# Altium schematic sheet Relays.SchDoc
size Letter; SheetNumber: 1; SheetTotal: 5
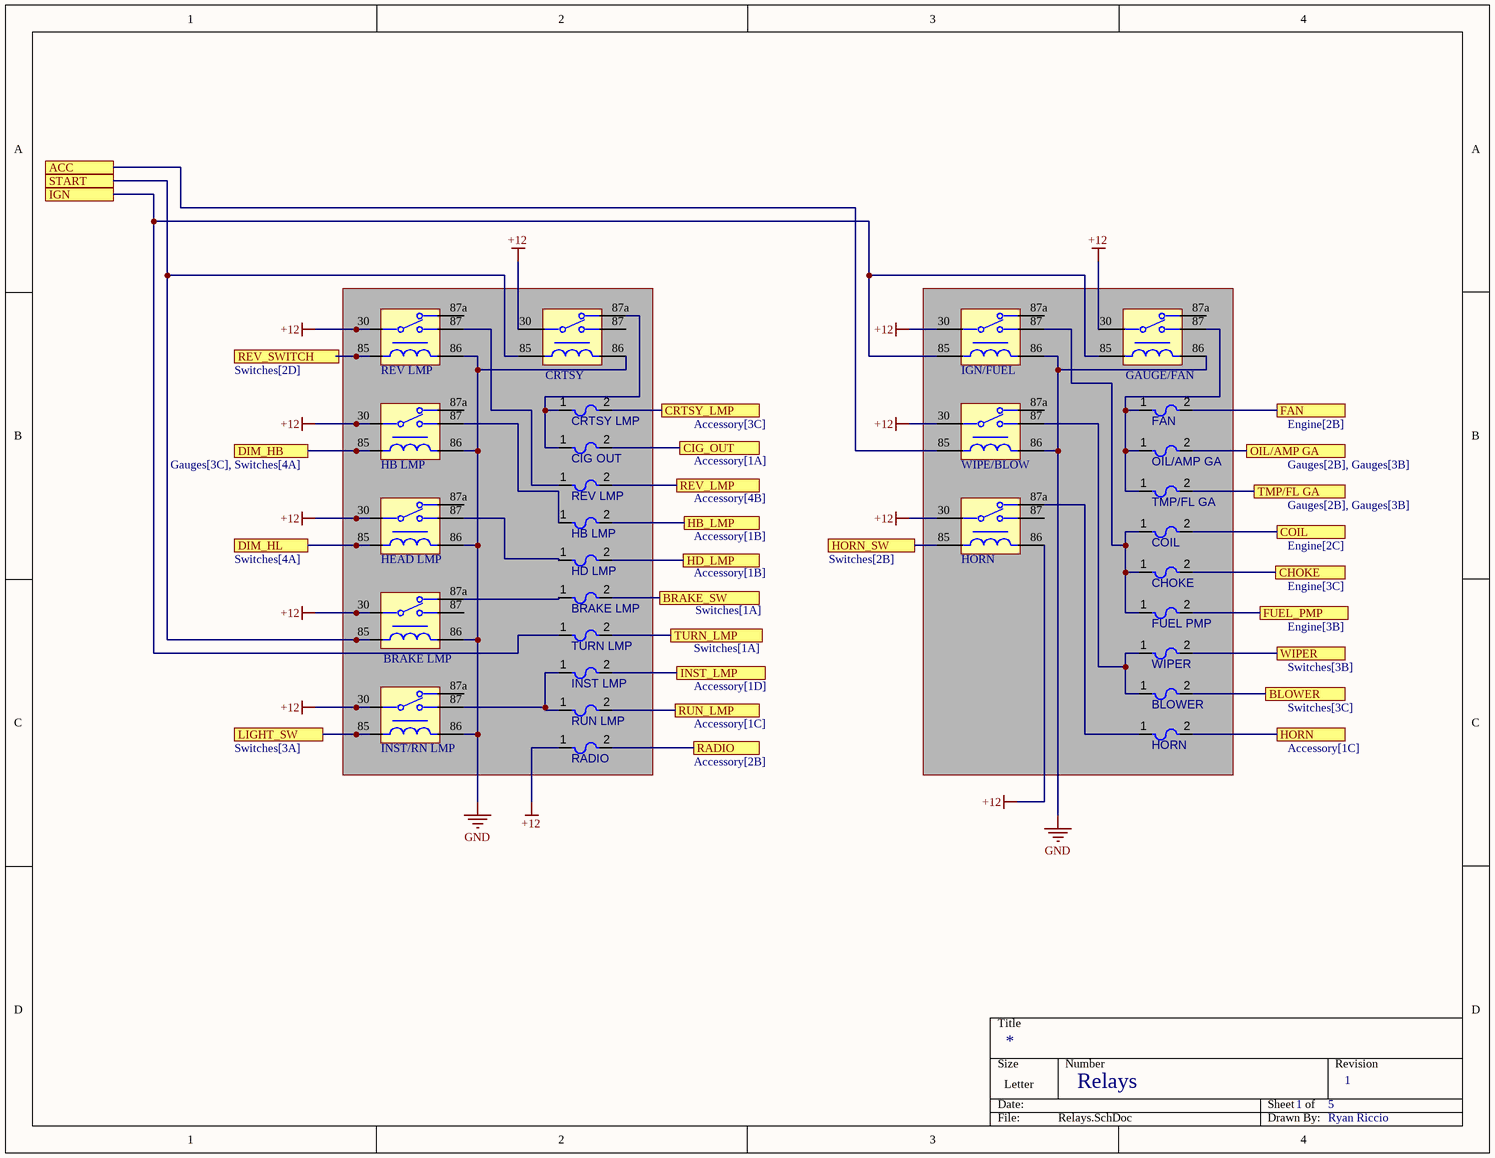
[diagram p0: Relays.SchDoc]

## Parts
(Parts that share a designator on the sheet are numbered #1, #2 ... from top to bottom, then left to right.)
F?#1  CRTSY LMP  [LFUS-467_V]
F?#2  FAN  [LFUS-467_V]
F?#3  CIG OUT  [LFUS-467_V]
F?#4  OIL/AMP GA  [LFUS-467_V]
F?#5  REV LMP  [LFUS-467_V]
F?#6  TMP/FL GA  [LFUS-467_V]
F?#7  HB LMP  [LFUS-467_V]
F?#8  COIL  [LFUS-467_V]
F?#9  HD LMP  [LFUS-467_V]
F?#10  CHOKE  [LFUS-467_V]
F?#11  BRAKE LMP  [LFUS-467_V]
F?#12  FUEL PMP  [LFUS-467_V]
F?#13  TURN LMP  [LFUS-467_V]
F?#14  WIPER  [LFUS-467_V]
F?#15  INST LMP  [LFUS-467_V]
F?#16  BLOWER  [LFUS-467_V]
F?#17  RUN LMP  [LFUS-467_V]
F?#18  HORN  [LFUS-467_V]
F?#19  RADIO  [LFUS-467_V]
K?#1  REV LMP  [FP-CB1-P-12V-MFG]
K?#2  CRTSY  [FP-CB1-P-12V-MFG]
K?#3  IGN/FUEL  [FP-CB1-P-12V-MFG]
K?#4  GAUGE/FAN  [FP-CB1-P-12V-MFG]
K?#5  HB LMP  [FP-CB1-P-12V-MFG]
K?#6  WIPE/BLOW  [FP-CB1-P-12V-MFG]
K?#7  HEAD LMP  [FP-CB1-P-12V-MFG]
K?#8  HORN  [FP-CB1-P-12V-MFG]
K?#9  BRAKE LMP  [FP-CB1-P-12V-MFG]
K?#10  INST/RN LMP  [FP-CB1-P-12V-MFG]

## Ports
ACC (see Accessory[2B], Switches[1D]), BLOWER (see Switches[3C]), BRAKE_SW (see Switches[1A]), CHOKE (see Engine[3C]), CIG_OUT (see Accessory[1A]), COIL (see Engine[2C]), CRTSY_LMP (see Accessory[3C]), DIM_HB (see Gauges[3C], Switches[4A]), DIM_HL (see Switches[4A]), FAN (see Engine[2B]), FUEL_PMP (see Engine[3B]), HB_LMP (see Accessory[1B]), HD_LMP (see Accessory[1B]), HORN (see Accessory[1C]), HORN_SW (see Switches[2B]), IGN (see Switches[2C], Switches[2D], Switches[3A]), INST_LMP (see Accessory[1D]), LIGHT_SW (see Switches[3A]), OIL/AMP GA (see Gauges[2B], Gauges[3B]), RADIO (see Accessory[2B]), REV_LMP (see Accessory[4B]), REV_SWITCH (see Switches[2D]), RUN_LMP (see Accessory[1C]), START (see Switches[2D]), TMP/FL GA (see Gauges[2B], Gauges[3B]), TURN_LMP (see Switches[1A]), WIPER (see Switches[3B])

## Nets
+12: F?#19.1 K?#1.30 K?#2.30 K?#3.30 K?#4.30 K?#5.30 K?#6.30 K?#7.30 K?#8.30 K?#8.86 K?#9.30 K?#10.30
GND: K?#1.86 K?#2.86 K?#3.86 K?#4.86 K?#5.86 K?#6.86 K?#7.86 K?#9.86 K?#10.86
ACC: K?#6.85 ; port ACC
BLOWER: F?#16.2 ; port BLOWER
BRAKE_SW: F?#11.2 ; port BRAKE_SW
CHOKE: F?#10.2 ; port CHOKE
CIG_OUT: F?#3.2 ; port CIG_OUT
COIL: F?#8.2 ; port COIL
CRTSY_LMP: F?#1.2 ; port CRTSY_LMP
DIM_HB: K?#5.85 ; port DIM_HB
DIM_HL: K?#7.85 ; port DIM_HL
FAN: F?#2.2 ; port FAN
FUEL_PMP: F?#12.2 ; port FUEL_PMP
HB_LMP: F?#7.2 ; port HB_LMP
HD_LMP: F?#9.2 ; port HD_LMP
HORN: F?#18.2 ; port HORN
HORN_SW: K?#8.85 ; port HORN_SW
IGN: F?#13.1 K?#3.85 K?#4.85 ; port IGN
INST_LMP: F?#15.2 ; port INST_LMP
LIGHT_SW: K?#10.85 ; port LIGHT_SW
OIL/AMP GA: F?#4.2 ; port OIL/AMP GA
RADIO: F?#19.2 ; port RADIO
REV_LMP: F?#5.2 ; port REV_LMP
REV_SWITCH: K?#1.85 ; port REV_SWITCH
RUN_LMP: F?#17.2 ; port RUN_LMP
START: K?#2.85 K?#9.85 ; port START
TMP/FL GA: F?#6.2 ; port TMP/FL GA
TURN_LMP: F?#13.2 ; port TURN_LMP
WIPER: F?#14.2 ; port WIPER
NetF?#1_1: F?#1.1 F?#3.1 K?#2.87a
NetF?#2_1: F?#2.1 F?#4.1 F?#6.1 K?#4.87
NetF?#5_1: F?#5.1 K?#1.87
NetF?#7_1: F?#7.1 K?#5.87
NetF?#8_1: F?#8.1 F?#10.1 F?#12.1 K?#3.87
NetF?#9_1: F?#9.1 K?#7.87
NetF?#11_1: F?#11.1 K?#9.87a
NetF?#14_1: F?#14.1 F?#16.1 K?#6.87
NetF?#15_1: F?#15.1 F?#17.1 K?#10.87
NetF?#18_1: F?#18.1 K?#8.87a

Not connected (* = marked no-connect by the designer): K?#1 87a; K?#2 87; K?#3 87a; K?#4 87a; K?#5 87a; K?#6 87a; K?#7 87a; K?#8 87; K?#9 87; K?#10 87a

## Notes on the sheet
- Relays
- 1
- Ryan Riccio

## Library data of the parts
F?#1-F?#19 = CMP-005-00011-2: Fast Acting Fuse, 2 A, 32 V, -55 to 90 degC, 2-Pin SMD, RoHS, Tape and Reel; Current Rating: 2A; Case/Package: LFUS-467; Mounting Technology: SurfaceMount; Pins: 2
K?#1-K?#10 = CMP-008-00005-1: Relays 12VDC 103Ohm 40(NO)/30(NC)A SPDT(26mm 22mm 26mm) THT Automotive Relay Automotive